# EAGLE design TUBEIV (EAGLE 5.07)
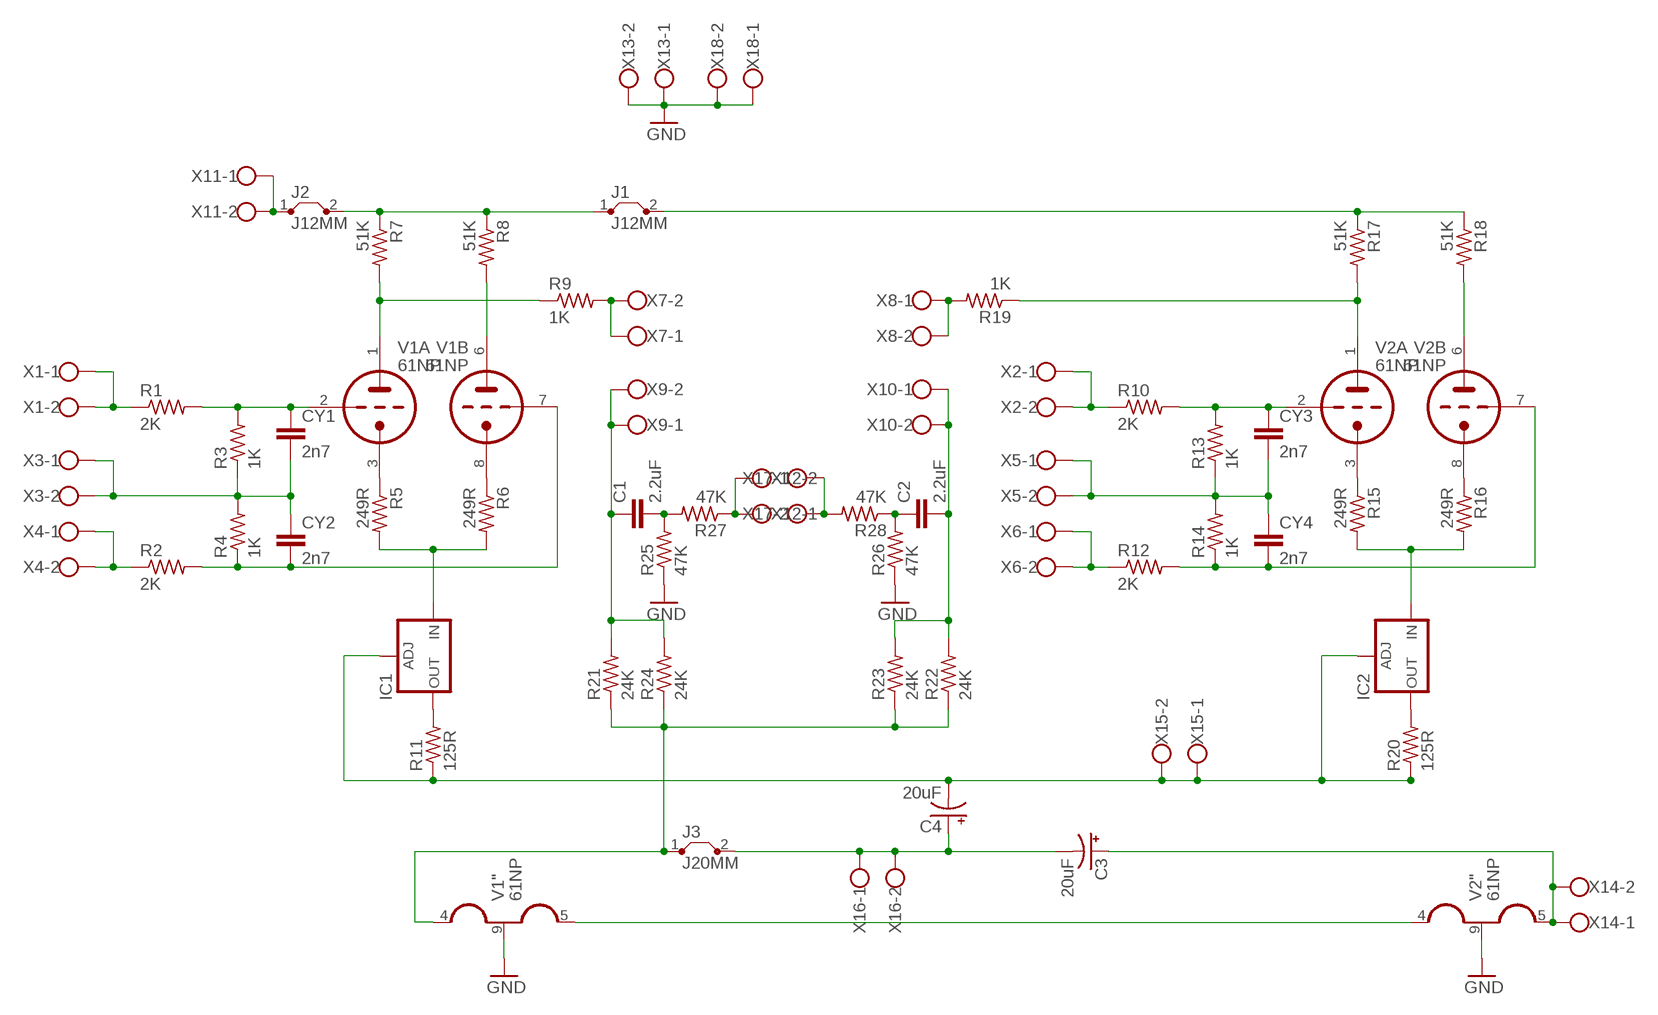
[diagram p0: schematic, sheet 1]

## Parts
C1  2.2uF  C37/15  [C37.5B15]
C2  2.2uF  C37/15  [C37.5B15]
C3  20uF  CPOL-USE15-5AXIAL  [E15-5]
C4  20uF  CPOL-USE15-5AXIAL  [E15-5]
CY1  2n7  CYYC15B5  [YC15B5]
CY2  2n7  CYYC15B5  [YC15B5]
CY3  2n7  CYYC15B5  [YC15B5]
CY4  2n7  CYYC15B5  [YC15B5]
IC1  LM317TS  [317TS]
IC2  LM317TS  [317TS]
J1  J12MM  [12]
J2  J12MM  [12]
J3  J20MM  [20]
R1  2K  R-US_0617/22  [0617/22]
R2  2K  R-US_0617/22  [0617/22]
R3  1K  R-US_0617/22  [0617/22]
R4  1K  R-US_0617/22  [0617/22]
R5  249R  R-US_0411/15  [0411/15]
R6  249R  R-US_0309/12  [0309/12]
R7  51K  R-US_0617/17  [0617/17]
R8  51K  R-US_0617/22  [0617/22]
R9  1K  R-US_0617/22  [0617/22]
R10  2K  R-US_0617/22  [0617/22]
R11  125R  R-US_0309/12  [0309/12]
R12  2K  R-US_0617/22  [0617/22]
R13  1K  R-US_0617/22  [0617/22]
R14  1K  R-US_0617/22  [0617/22]
R15  249R  R-US_0309/12  [0309/12]
R16  249R  R-US_0207/15  [0207/15]
R17  51K  R-US_0617/22  [0617/22]
R18  51K  R-US_0617/22  [0617/22]
R19  1K  R-US_0617/22  [0617/22]
R20  125R  R-US_0309/12  [0309/12]
R21  24K  R-US_0617/22  [0617/22]
R22  24K  R-US_0617/22  [0617/22]
R23  24K  R-US_0617/22  [0617/22]
R24  24K  R-US_0617/22  [0617/22]
R25  47K  R-US_0617/22  [0617/22]
R26  47K  R-US_0617/22  [0617/22]
R27  47K  R-US_0617/22  [0617/22]
R28  47K  R-US_0617/22  [0617/22]
V1  61NP  E88CC-P  [NOVAL]
V2  61NP  E88CC-P  [NOVAL]
X1  W237-102  [W237-102]
X2  W237-102  [W237-102]
X3  W237-102  [W237-102]
X4  W237-102  [W237-102]
X5  W237-102  [W237-102]
X6  W237-102  [W237-102]
X7  W237-102  [W237-102]
X8  W237-102  [W237-102]
X9  W237-102  [W237-102]
X10  W237-102  [W237-102]
X11  W237-102  [W237-102]
X12  W237-102  [W237-102]
X13  W237-102  [W237-102]
X14  W237-102  [W237-102]
X15  W237-102  [W237-102]
X16  W237-102  [W237-102]
X17  W237-102  [W237-102]
X18  W237-102  [W237-102]

## Nets
GND: R25.1 R26.1 V1.9(":H2) V2.9(":H2) X13.1 X13.2 X18.1 X18.2
N$1: CY1.1 R1.2 R3.2 V1.2(A:TG)
N$2: CY2.2 R2.2 R4.1 V1.7(B:TG)
N$3: CY1.2 CY2.1 R3.1 R4.2 X3.1 X3.2
N$4: R1.1 X1.1 X1.2
N$5: R5.1 V1.3(A:TK)
N$6: R6.1 V1.8(B:TK)
N$7: R2.1 X4.1 X4.2
N$8: IC1.3(IN) R5.2 R6.2
N$9: R7.2 R9.1 V1.1(A:TA)
N$10: R8.2 V1.6(B:TA)
N$11: J1.1 J2.2 R7.1 R8.1
N$12: R9.2 X7.1 X7.2
N$13: CY3.1 R10.2 R13.2 V2.2(A:TG)
N$14: C4.- IC1.1(ADJ) IC2.1(ADJ) R11.1 R20.1 X15.1 X15.2
N$15: IC1.2(OUT) R11.2
N$16: CY4.2 R12.2 R14.1 V2.7(B:TG)
N$17: CY3.2 CY4.1 R13.1 R14.2 X5.1 X5.2
N$18: R10.1 X2.1 X2.2
N$19: R12.1 X6.1 X6.2
N$20: R15.1 V2.3(A:TK)
N$21: R16.1 V2.8(B:TK)
N$22: IC2.3(IN) R15.2 R16.2
N$23: R17.2 R19.1 V2.1(A:TA)
N$24: R18.2 V2.6(B:TA)
N$25: C1.2 R25.2 R27.2
N$26: V1.5(":H3) V2.4(":H1)
N$27: R19.2 X8.1 X8.2
N$28: IC2.2(OUT) R20.2
N$29: J1.2 R17.1 R18.1
N$30: C1.1 R21.2 R24.2 X9.1 X9.2
N$31: C2.2 R22.2 R23.2 X10.1 X10.2
N$32: C2.1 R26.2 R28.1
N$33: J2.1 X11.1 X11.2
N$34: R27.1 X12.1 X12.2
N$35: J3.1 R21.1 R22.1 R23.1 R24.1 V1.4(":H1)
N$36: C3.+ V2.5(":H3) X14.1 X14.2
N$37: C3.- C4.+ J3.2 X16.1 X16.2
N$38: R28.2 X17.1 X17.2

## Library data of the parts
C1 C2 = capacitor-wima:C: CAPACITOR naming: grid - package width
C3 C4 = resistor:CPOL-US: POLARIZED CAPACITOR, American symbol
CY1-CY4 = resistor:CY: Y CAPACITOR for power line
IC1 IC2 = v-reg:LM317TS: VOLTAGE REGULATOR
J1-J3 = jumper:J: Bridge
R1-R28 = resistor:R-US_: RESISTOR, American symbol
V1 V2 = TUBE1:E88CC-P
X1-X18 = con-wago-500:W237-102: WAGO SCREW CLAMP

## Board
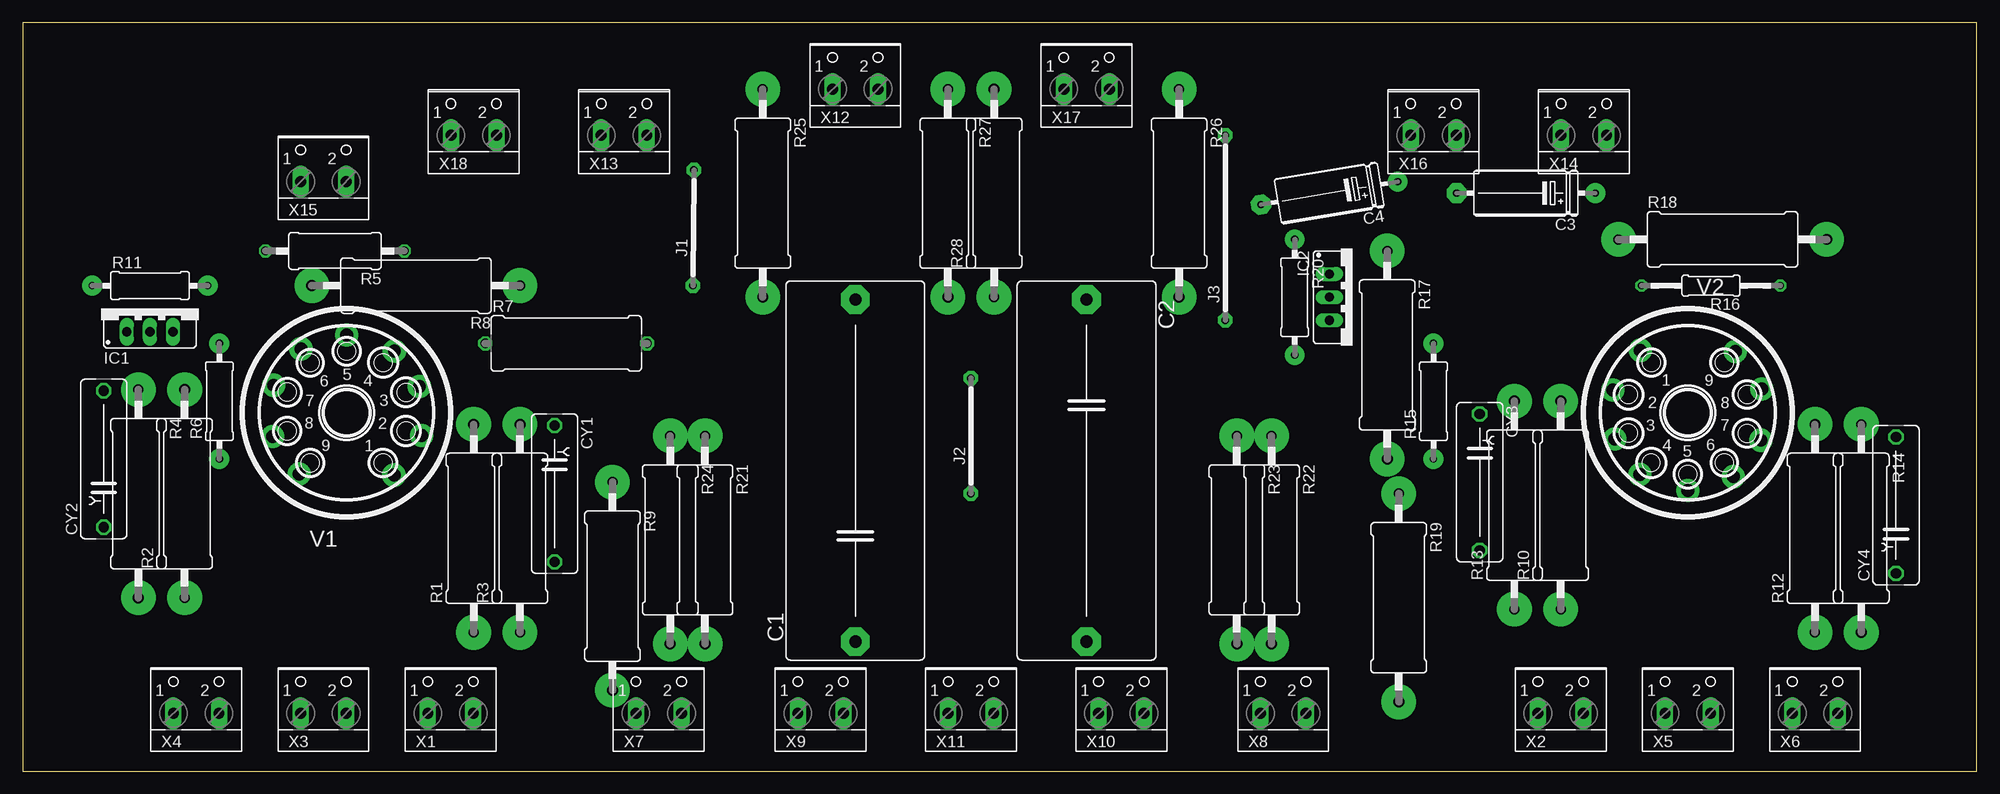
[diagram p1: board, top side]
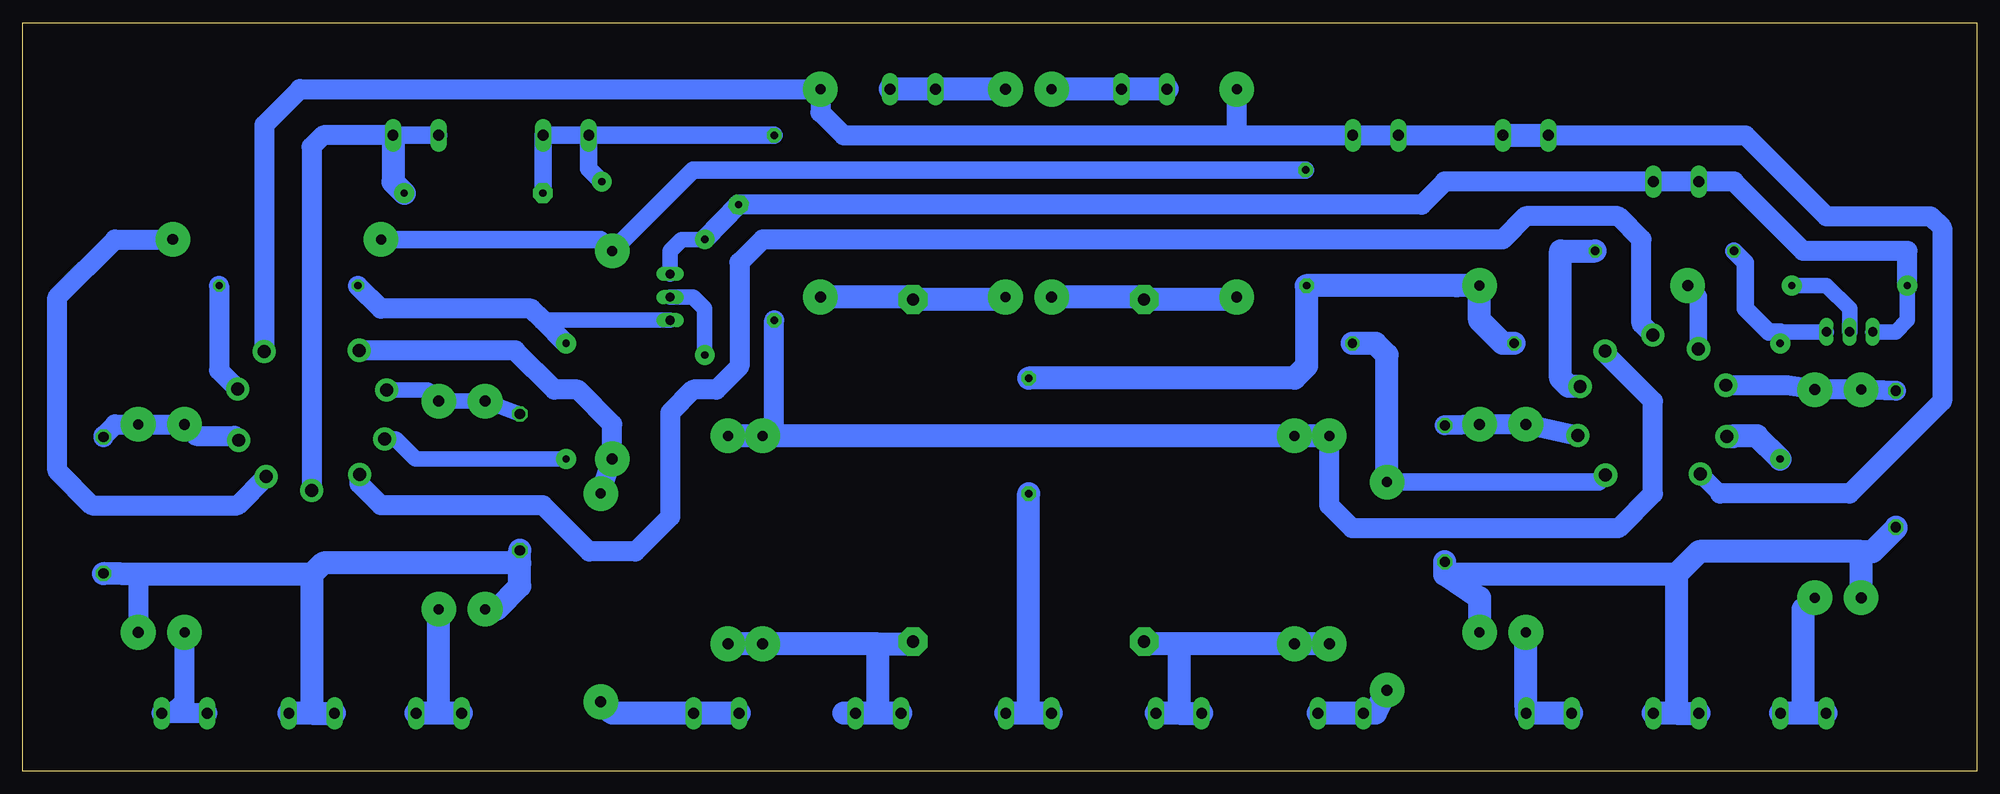
[diagram p2: board, bottom side, seen from below]

Size 214.61 x 82.22 mm. Coordinates in mm from the lower left corner, seen from the top.
Outline: 0,0 214.61,0 214.61,82.22 0,82.22 0,0
Copper layers (1*16): Top 0.035mm / dielectric 1.5mm / Bottom 0.035mm
Design rules "default": minimum track width 10mil, minimum drill 24mil, track to track 8mil, track to pad 8mil, pad to pad 8mil, via to via 8mil, smd to smd 8mil, copper to edge 40mil, drill to drill 8mil, minimum pad ring 10mil, minimum via ring 8mil, stop-mask expansion 4mil, vias tented up to drill 0mil, thermal gap 10mil

### Footprints (pad centres in the part's own frame; a part is rotated, then mirrored left to right if it is on the bottom)
C37.5B15 = drill 1.321 pad 3.15 octagon: 1 -18.796,0; 2 18.796,0
E15-5 = drill 0.813 pad 2.159 round: + -7.62,0 | drill 0.813 pad 2.159 octagon: - 7.62,0
YC15B5 = drill 1.118 octagon: 1 -7.493,0; 2 7.493,0
317TS = drill 1.016 long: 1 -2.54,-2.54; 2 0,-2.54; 3 2.54,-2.54
12 = drill 0.813 pad 1.6 octagon: 1 -6.35,0; 2 6.35,0
20 = drill 0.813 pad 1.6 octagon: 1 -10.16,0; 2 10.16,0
0617/22 = drill 1.1 pad 3.81 round: 1 -11.43,0 | drill 1.2 pad 3.81 round: 2 11.43,0
0411/15 = drill 0.914 octagon: 1 -7.62,0; 2 7.62,0
0309/12 = drill 0.8 pad 2.184 round: 1 -6.35,0; 2 6.35,0
0617/17 = drill 1.016 octagon: 1 -8.89,0; 2 8.89,0
0207/15 = drill 0.813 octagon: 1 -7.62,0; 2 7.62,0
NOVAL = drill 1.422 pad 2.54 round: 1 5.207,-6.858; 2 8.254,-2.484; 3 8.004,2.893; 4 5.258,6.77; 5 0,8.524; 6 -5.004,7.024; 7 -8.004,3.02; 8 -8.127,-2.611; 9 -5.207,-6.731
W237-102 = drill 1.194 long: 1 -2.5,-1.27; 2 2.5,-1.27

### Placement (x,y rotation side)
C1  91.44,33.02 90 top
C2  116.84,33.02 270 top
C3  165.1,63.5 180 top
C4  143.51,63.5 189.5 top
CY1  58.42,30.48 270 top
CY2  8.89,34.29 90 top
CY3  160.02,31.75 270 top
CY4  205.74,29.21 90 top
IC1  13.97,50.8 0 top
IC2  146.05,52.07 270 top
J1  73.66,59.69 89.5 top
J2  104.14,36.83 90 top
J3  132.08,59.69 90 top
R1  49.53,26.67 90 top
R2  17.78,30.48 90 top
R3  54.61,26.67 90 top
R4  12.7,30.48 270 top
R5  34.29,57.15 180 top
R6  21.59,40.64 90 top
R7  59.69,46.99 0 top
R8  43.18,53.34 180 top
R9  64.77,20.32 270 top
R10  168.91,29.21 90 top
R11  13.97,53.34 0 top
R12  196.85,26.67 90 top
R13  163.83,29.21 90 top
R14  201.93,26.67 270 top
R15  154.94,40.64 90 top
R16  185.42,53.34 180 top
R17  149.86,45.72 270 top
R18  186.69,58.42 0 top
R19  151.13,19.05 270 top
R20  139.7,52.07 270 top
R21  74.93,25.4 270 top
R22  137.16,25.4 270 top
R23  133.35,25.4 270 top
R24  71.12,25.4 270 top
R25  81.28,63.5 270 top
R26  127,63.5 270 top
R27  101.6,63.5 270 top
R28  106.68,63.5 90 top
V1  35.56,39.37 0 top
V2  182.88,39.37 180 top
X1  46.99,7.62 0 top
X2  168.91,7.62 0 top
X3  33.02,7.62 0 top
X4  19.05,7.62 0 top
X5  182.88,7.62 0 top
X6  196.85,7.62 0 top
X7  69.85,7.62 0 top
X8  138.43,7.62 0 top
X9  87.63,7.62 0 top
X10  120.65,7.62 0 top
X11  104.14,7.62 0 top
X12  91.44,76.2 0 top
X13  66.04,71.12 0 top
X14  171.45,71.12 0 top
X15  33.02,66.04 0 top
X16  154.94,71.12 0 top
X17  116.84,76.2 0 top
X18  49.53,71.12 0 top

### Tracks (layer width: path | path; a pad name or v marks a point on that pad's centre or on a via)
GND  (1 unrouted)
  Bottom 1.93: 28.19,30.48 V1.9
  Bottom 2.184: 81.28,69.85 R25.1 | 81.28,69.85 124.46,69.85 127,72.39 R26.1 184.15,74.93 188.09,70.99 V2.9 | 28.19,30.48 13.97,30.48 3.81,40.64 3.81,59.69 5.08,60.96 16.51,60.96 25.4,69.85 X18.1 | 81.28,69.85 X13.2 X13.1 52.07,69.85
  Bottom 2.54: X18.1 48.26,69.85 52.07,69.85
N$1
  Bottom 2.184: V1.2 43.87,36.83 R1.2 R3.2 CY1.1
N$2
  Bottom 2.184: CY2.2 R4.1 R2.2 20.8,42.39 V1.7
N$3
  Bottom 2.54: 33.02,6.35 X3.1 | R3.1 54.61,19.05 58.42,21.59 | 58.42,21.59 CY1.2 | CY2.1 8.89,26.67 11.43,24.13 12.7,24.13 | R4.2 12.7,24.13 | 33.02,21.59 58.42,21.59 | 33.02,6.35 X3.2 | 33.02,21.59 33.02,6.35 | 12.7,24.13 30.48,24.13 33.02,21.59
N$4
  Bottom 2.54: X1.1 X1.2 49.53,7.66 R1.1
N$5
  Bottom 2.54: R5.1 45.72,57.15 45.72,43.18 44.8,42.26 V1.3
N$6
  Bottom 2.54: R6.1 24.13,36.83 26.67,36.83 26.74,36.76 V1.8
N$7
  Bottom 2.54: X4.1 19.05,6.35 | 19.05,6.35 X4.2 20.32,6.39 | R2.1 19.05,17.78 19.05,6.35
N$8
  Bottom 1.676: IC1.3 21.59,48.26
  Bottom 1.93: R6.2 21.59,48.26 22.86,48.26 25.4,50.8 25.4,55.88 R5.2
N$9
  Bottom 1.93: V1.1 41.53,31.75 R9.1
  Bottom 2.54: R9.1 64.77,45.72 66.04,46.99 R7.2
N$10
  Bottom 1.93: R8.2 30.56,52.15 V1.6
N$11
  Bottom 2.54: R7.1 52.07,46.99 54.61,49.53 R8.1 57.15,53.34 J1.1 | J1.1 73.66,53.34 | J2.2 74.93,43.18 73.6,44.5 J1.1
N$12
  Bottom 2.54: R9.2 66.04,6.35 X7.1 X7.2
N$13
  Bottom 1.676: V2.2 170.12,41.85 R10.2 R13.2 CY3.1
N$14
  Bottom 1.676: IC1.1 8.89,48.26 7.62,49.53 R11.1 | R20.1 142.24,58.42 143.51,57.15 IC2.1
  Bottom 2.184: R11.1 7.62,57.15 19.05,57.15 26.67,64.77 X15.1 X15.2 58.42,64.77 60.96,62.23 C4.- R20.1
N$15
  Bottom 1.676: IC1.2 13.97,50.8 16.51,53.34 R11.2
N$16
  Bottom 2.184: CY4.2 205.74,36.83 204.47,38.1 R14.1 R12.2 195.58,36.83 191.36,36.83 V2.7
N$17
  Bottom 2.184: 162.6,17.74 162.56,17.78 | 201.93,21.59 R14.2
  Bottom 2.54: 160.02,22.86 160.02,20.32 162.56,17.78 R13.1 | 160.02,22.86 CY3.2 | 182.88,21.59 201.93,21.59 CY4.1 | 182.88,6.35 X5.2 | 182.88,6.35 X5.1 | 182.88,21.59 182.88,6.35 | 182.88,21.59 181.61,22.86 160.02,22.86
N$18
  Bottom 2.54: X2.1 168.91,6.35 | 168.91,6.35 X2.2 | 168.91,6.35 R10.1
N$19
  Bottom 2.184: X6.2 X6.1 198.12,6.35 196.85,7.62 R12.1
N$20
  Bottom 1.676: R15.1 171.45,34.29 173.64,36.48 V2.3
N$21
  Bottom 2.184: V2.8 193.04,44.01 R16.1
N$22
  Bottom 1.676: IC2.3 157.48,49.53
  Bottom 2.184: R15.2 157.48,49.53 158.75,50.8 175.26,50.8 R16.2
N$23
  Bottom 2.184: V2.1 160.53,46.23 156.21,41.91 153.67,41.91 149.86,38.1 R17.2 R19.1
N$24
  Bottom 2.184: V2.6 191.02,29.21 207.01,29.21 210.82,33.02 210.82,52.07 204.47,58.42 R18.2
N$25
  Bottom 2.54: R25.2 81.53,51.82 C1.2 91.69,52.07 R27.2
N$26
  Bottom 2.184: V1.5 36.83,49.16 36.83,58.42 39.37,60.96 49.53,60.96 52.07,58.42 133.35,58.42 135.89,55.88 135.89,44.45 138.43,41.91 140.97,41.91 143.51,39.37 143.51,27.94 147.32,24.13 152.4,24.13 157.48,29.21 175.26,29.21 177.62,31.57 V2.4
N$27
  Bottom 2.54: X8.1 X8.2 149.86,6.35 R19.2
N$28
  Bottom 1.676: IC2.2 140.97,52.07 139.7,50.8 R20.2
N$29
  Bottom 1.93: J1.2 140.97,66.04 R17.1 151.13,58.42 R18.1
N$30
  Bottom 2.54: R24.2 R21.2 87.63,13.97 | 87.63,13.97 91.44,13.97 C1.1 | 87.63,6.35 X9.1 | 87.63,6.35 X9.2 | 87.63,13.97 87.63,6.35
N$31
  Bottom 2.184: 120.65,6.35 X10.2
  Bottom 2.54: C2.2 117.09,13.97 120.65,13.97 | 120.65,13.97 R23.2 R22.2 | X10.1 120.65,6.35 | 120.65,6.35 124.46,6.35 | 120.65,6.35 120.65,13.97
N$32
  Bottom 2.54: R28.1 106.93,51.82 C2.1 117.09,52.07 R26.2
N$33
  Bottom 2.54: X11.1 104.14,6.35 | 104.14,6.35 X11.2 | 104.14,6.35 J2.1
N$34
  Bottom 2.54: X12.1 X12.2 R27.1
N$35
  Bottom 1.93: 35.56,40.64 35.56,37.85 | 40.82,45.9 V1.4
  Bottom 2.184: 40.82,45.9 35.56,40.64 35.56,30.48 39.37,26.67 68.58,26.67 71.12,29.21 R24.1 | 132.08,36.83 J3.1
  Bottom 2.54: R22.1 R23.1 132.08,36.83 R21.1 R24.1
N$36
  Bottom 1.93: X14.2 X14.1
  Bottom 2.184: V2.5 182.88,68.58 181.61,69.85 X14.2
  Bottom 2.54: C3.+ 173.95,64.73 X14.2
N$37
  Bottom 1.93: C4.+ 152.44,66.17 X16.1 | C3.- 157.44,64.81 X16.2 X16.1 | J3.2 X16.1
N$38
  Bottom 2.54: R28.2 X17.1 X17.2